# EAGLE design 611_jetbot_010210 (EAGLE 9.6.2)
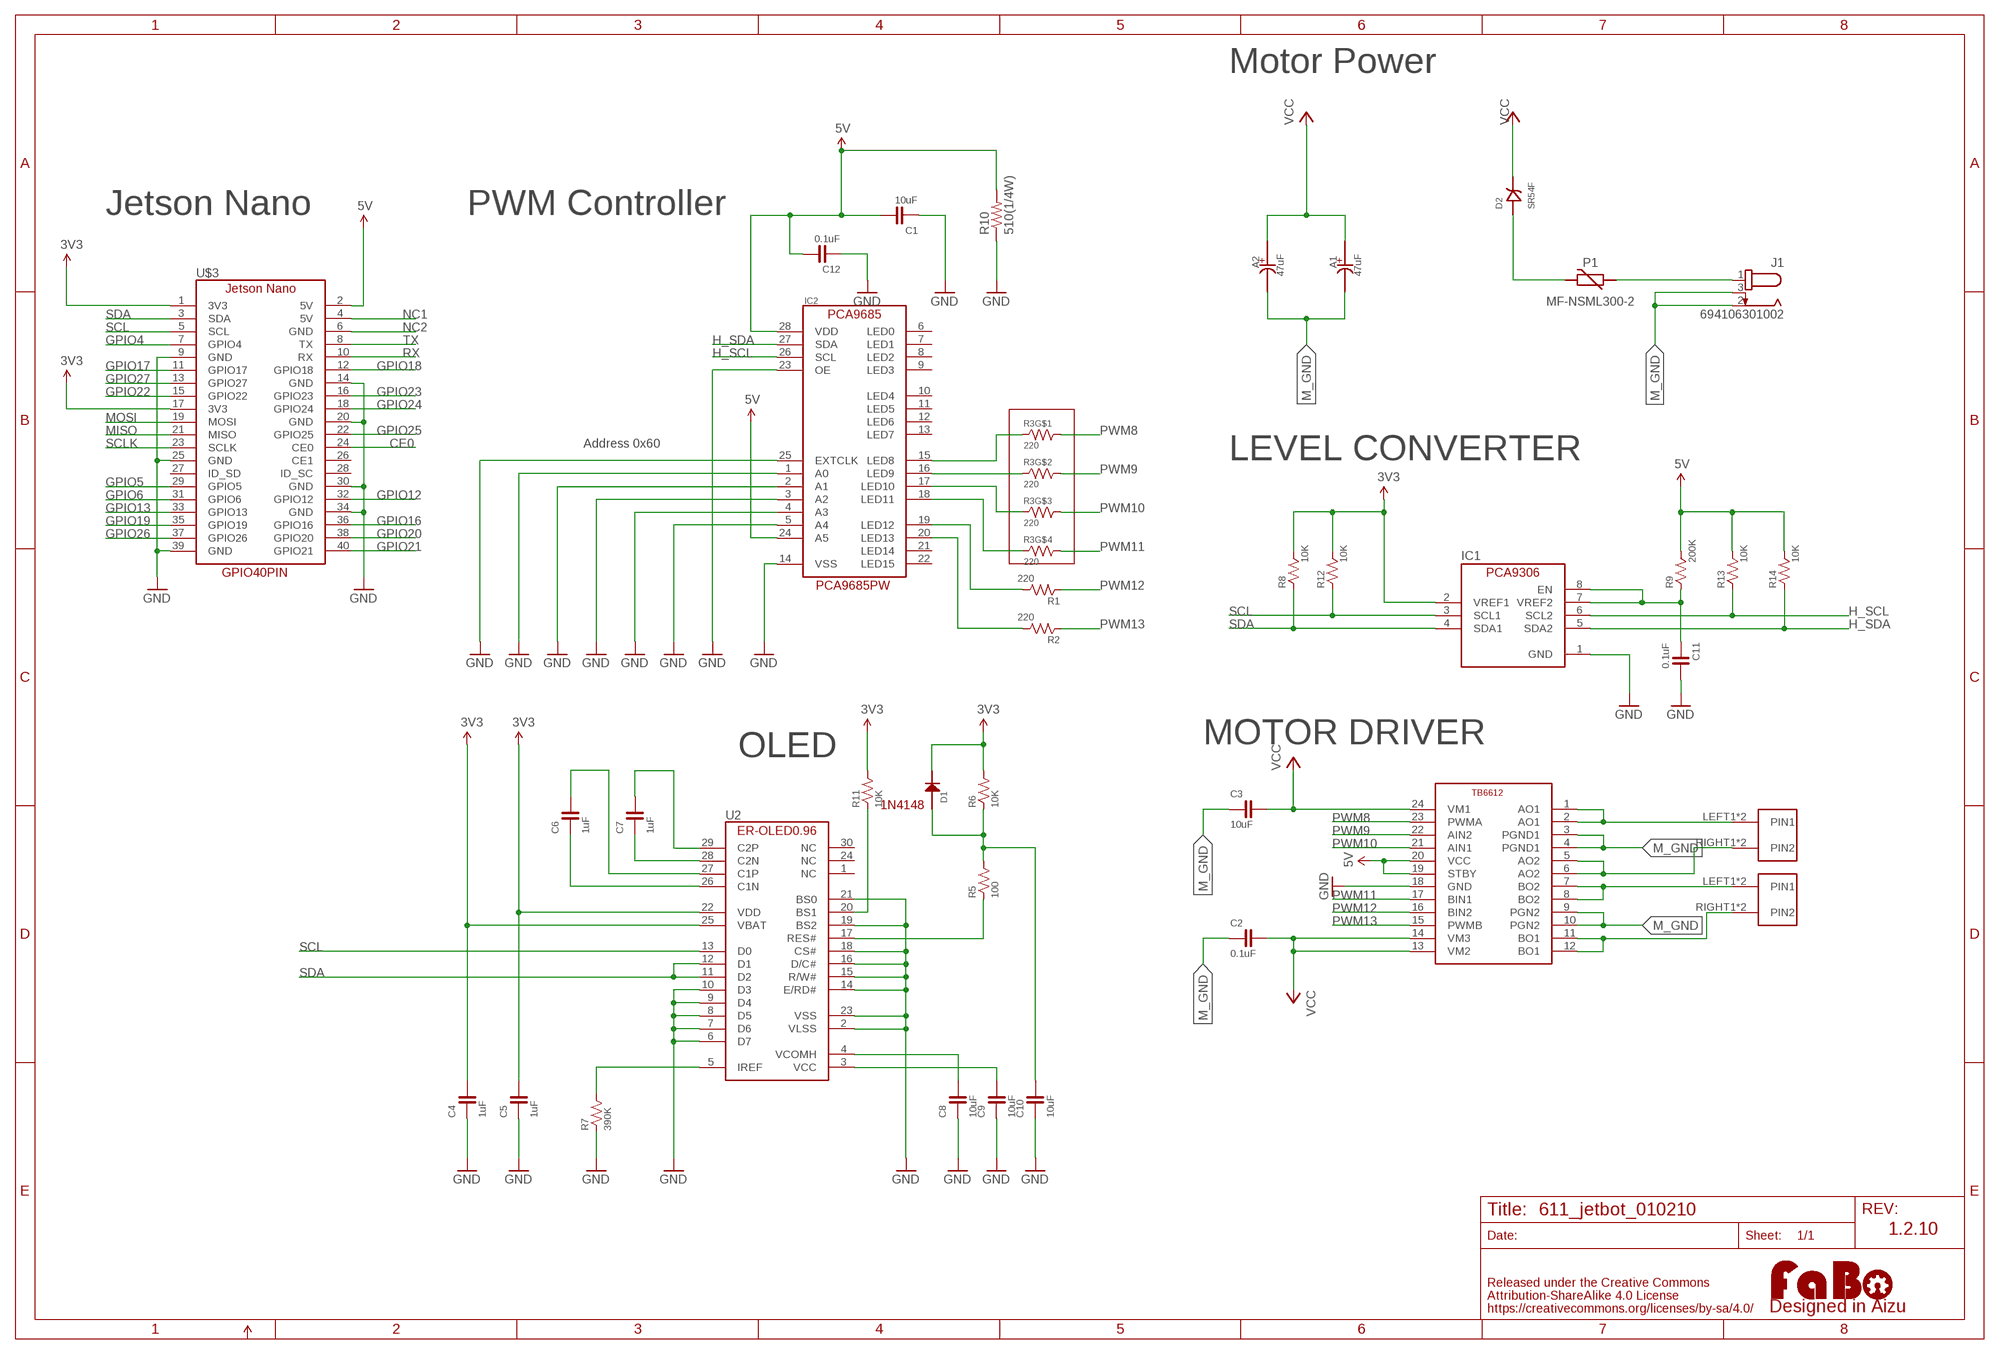
[diagram p0: schematic, sheet 1]

## Parts
A1  47uF  CAPACITOR-ALUMIN_D60  [D60]
A2  47uF  CAPACITOR-ALUMIN_D60  [D60]
C1  10uF  CAPACITOR-0603  [0603]
C2  0.1uF  CAPACITOR-0603  [0603]
C3  10uF  CAPACITOR-0603  [0603]
C4  1uF  CAPACITOR-0603-BOTTOM  [0603-BOTTOM]
C5  1uF  CAPACITOR-0603-BOTTOM  [0603-BOTTOM]
C6  1uF  CAPACITOR-0603-BOTTOM  [0603-BOTTOM]
C7  1uF  CAPACITOR-0603-BOTTOM  [0603-BOTTOM]
C8  10uF  CAPACITOR-0603-BOTTOM  [0603-BOTTOM]
C9  10uF  CAPACITOR-0603-BOTTOM  [0603-BOTTOM]
C10  10uF  CAPACITOR-0603-BOTTOM  [0603-BOTTOM]
C11  0.1uF  CAPACITOR-0603  [0603]
C12  0.1uF  CAPACITOR-0603  [0603]
D1  1N4148  [1N4148W]
D2  SR54F  [SMBF]
IC1  PCA9306_SSOP  [8PIN-SSOP]
IC2  PCA9685PW,BS  [PCA9685]
J1  694106301002  [694106301002]
LOGO1  LOGO_FABO-M  [LOGO_FABO_M]
P1  MF-NSML300-2  POLYSWITCH1206  [1206]
R1  220  RESISTOR-0603  [0603]
R2  220  RESISTOR-0603  [0603]
R3  220  RESISTOR_ARRAY  [EXBV8V]
R5  100  RESISTOR-0603-BOTTOM  [0603-BOTTOM]
R6  10K  RESISTOR-0603-BOTTOM  [0603-BOTTOM]
R7  390K  RESISTOR-0603-BOTTOM  [0603-BOTTOM]
R8  10K  RESISTOR-0603  [0603]
R9  200K  RESISTOR-0603  [0603]
R10  510(1/4W)  R-US_R0805  [R0805]
R11  10K  RESISTOR-0603-BOTTOM  [0603-BOTTOM]
R12  10K  RESISTOR-0603  [0603]
R13  10K  RESISTOR-0603  [0603]
R14  10K  RESISTOR-0603  [0603]
U2  ER-OLED0.96-1ER-CON30HT-1_REV2  [ER-CON30HT-1_REV2]
U$3  JETSON_NANO  [JETSON_NANO]
U$5  TB6612  [TB6612]
U$6  ML-1400-S1  [ML-1400-S1]
U$8  ML-1400-S1  [ML-1400-S1]

## Nets
3V3: C4.2 C5.2 D1.CATHODE IC1.2(VREF1) R6.2 R8.2 R11.2 R12.2 U2.22(VDD) U2.25(VBAT) U$3.1(3V3) U$3.17(3V3)
5V: C1.2 C12.2 IC2.24(A5) IC2.28(VDD) R9.2 R10.2 R13.2 R14.2 U$3.2(5V) U$5.19(STBY) U$5.20(VCC)
CE0: U$3.24(CE0)
GND: C1.1 C4.1 C5.1 C8.1 C9.1 C10.1 C11.2 C12.1 IC1.1(GND) IC2.1(A0) IC2.2(A1) IC2.3(A2) IC2.4(A3) IC2.5(A4) IC2.14(VSS) IC2.23(OE) IC2.25(EXTCLK) R7.1 R10.1 U2.2(VLSS) U2.6(D7) U2.7(D6) U2.8(D5) U2.9(D4) U2.10(D3) U2.14(E/RD#) U2.15(R/W#) U2.16(D/C#) U2.18(CS#) U2.19(BS2) U2.21(BS0) U2.23(VSS) U$3.9(GND) U$3.14(GND) U$3.20(GND) U$3.25(GND) U$3.30(GND) U$3.34(GND) U$3.39(GND) U$5.18(GND)
GPIO4: U$3.7(GPIO4)
GPIO5: U$3.29(GPIO5)
GPIO6: U$3.31(GPIO6)
GPIO12: U$3.32(GPIO12)
GPIO13: U$3.33(GPIO13)
GPIO16: U$3.36(GPIO16)
GPIO17: U$3.11(GPIO17)
GPIO18: U$3.12(GPIO18)
GPIO19: U$3.35(GPIO19)
GPIO20: U$3.38(GPIO20)
GPIO21: U$3.40(GPIO21)
GPIO22: U$3.15(GPIO22)
GPIO23: U$3.16(GPIO23)
GPIO24: U$3.18(GPIO24)
GPIO25: U$3.22(GPIO25)
GPIO26: U$3.37(GPIO26)
GPIO27: U$3.13(GPIO27)
H_SCL: IC1.6(SCL2) IC2.26(SCL) R13.1
H_SDA: IC1.5(SDA2) IC2.27(SDA) R14.1
M_GND: A1.MINUS(-) A2.MINUS(-) C2.1 C3.1 J1.2 J1.3 U$5.3(PGND1) U$5.4(PGND1) U$5.9(PGN2) U$5.10(PGN2)
MISO: U$3.21(MISO)
MOSI: U$3.19(MOSI)
N$14: C6.2 U2.27(C1P)
N$16: C6.1 U2.26(C1N)
N$17: U$5.1(AO1) U$5.2(AO1) U$6.LEFT1(PIN1) U$6.LEFT2(PIN1)
N$18: U$5.5(AO2) U$5.6(AO2) U$6.RIGHT1(PIN2) U$6.RIGHT2(PIN2)
N$19: C7.1 U2.28(C2N)
N$20: U$5.7(BO2) U$5.8(BO2) U$8.LEFT1(PIN1) U$8.LEFT2(PIN1)
N$21: C7.2 U2.29(C2P)
N$22: U$5.11(BO1) U$5.12(BO1) U$8.RIGHT1(PIN2) U$8.RIGHT2(PIN2)
N$23: R7.2 U2.5(IREF)
N$24: C8.2 U2.4(VCOMH)
N$25: C9.2 U2.3(VCC)
N$26: R5.1 U2.17(RES#)
N$27: C10.2 D1.ANODE R5.2 R6.1
N$28: R11.1 U2.20(BS1)
N$29: C11.1 IC1.7(VREF2) IC1.8(EN) R9.1
NC1: U$3.4(5V)
NC2: U$3.6(GND)
P8: IC2.15(LED8) R3.1
P9: IC2.16(LED9) R3.2
P10: IC2.17(LED10) R3.3
P11: IC2.18(LED11) R3.4
P12: IC2.19(LED12) R1.2
P13: IC2.20(LED13) R2.2
PTCP1: J1.1 P1.1
PTCP2: D2.ANODE P1.2
PWM8: R3.8 U$5.23(PWMA)
PWM9: R3.7 U$5.22(AIN2)
PWM10: R3.6 U$5.21(AIN1)
PWM11: R3.5 U$5.17(BIN1)
PWM12: R1.1 U$5.16(BIN2)
PWM13: R2.1 U$5.15(PWMB)
RX: U$3.10(RX)
SCL: IC1.3(SCL1) R12.1 U2.13(D0) U$3.5(SCL)
SCLK: U$3.23(SCLK)
SDA: IC1.4(SDA1) R8.1 U2.11(D2) U2.12(D1) U$3.3(SDA)
TX: U$3.8(TX)
VCC: A1.PLUS(+) A2.PLUS(+) C2.2 C3.2 D2.CATHODE U$5.13(VM2) U$5.14(VM3) U$5.24(VM1)
Unconnected: IC2.6(LED0) IC2.7(LED1) IC2.8(LED2) IC2.9(LED3) IC2.10(LED4) IC2.11(LED5) IC2.12(LED6) IC2.13(LED7) IC2.21(LED14) IC2.22(LED15) U2.1(NC) U2.24(NC) U2.30(NC) U$3.26(CE1) U$3.27(ID_SD) U$3.28(ID_SC)

## Notes on the sheet
- Motor Power
- Jetson Nano | PWM Controller
- Address 0x60
- LEVEL CONVERTER
- GPIO40PIN
- PCA9685PW
- MOTOR DRIVER
- OLED
- 1N4148
- 1.2.10

## Library data of the parts
A1 A2 = FaBo-Capacitor:CAPACITOR-ALUMIN
C1-C12 = FaBo-Capacitor:CAPACITOR: CAPACITOR
D1 = FaBo-Diode:1N4148
D2 = FaBo-Diode:SR54F: SURFACE MOUNT SCHOTTKY BARRIER RECTIFIER 40V Volts 5 Amperes SMBF molded plastic Forwaord Voltage 0.55V DC Reverse Current 0.1mA
IC1 = FaBo-LevelTranslator:PCA9306
IC2 = FaBo-Motor:PCA9685PW,BS
J1 = DC Power Jacks:694106301002: CONN PWR JACK 2.1X5.5MM SOLDER Manufacturer's datasheet <https://katalog.we-online.de/em/datasheet/6941xx301002.pdf>; CREATED_BY: PCBLayout.com; DIGIKEY_PART_NUMBER: 732-5930-ND; MANUFACTURER: Wurth Electronics Inc.; MPN: 694106301002
LOGO1 = component:LOGO_FABO
P1 = FaBo-Supply:POLYSWITCH
R1 R2 R5-R9 R11-R14 = FaBo-Resistors:RESISTOR: RESISTOR
R3 = component:RESISTOR_ARRAY
R10 = rcl:R-US_: RESISTOR, American symbol; SPICEPREFIX: R
U2 = FaBo-Display:ER-OLED0.96-1: ER-CON30HT-1 Rev2 wide distance 0.23mm
U$3 = FaBo-Boards:JETSON_NANO
U$5 = FaBo-Motor:TB6612
U$6 U$8 = FaBo-Terminal:ML-1400-S1

## Board
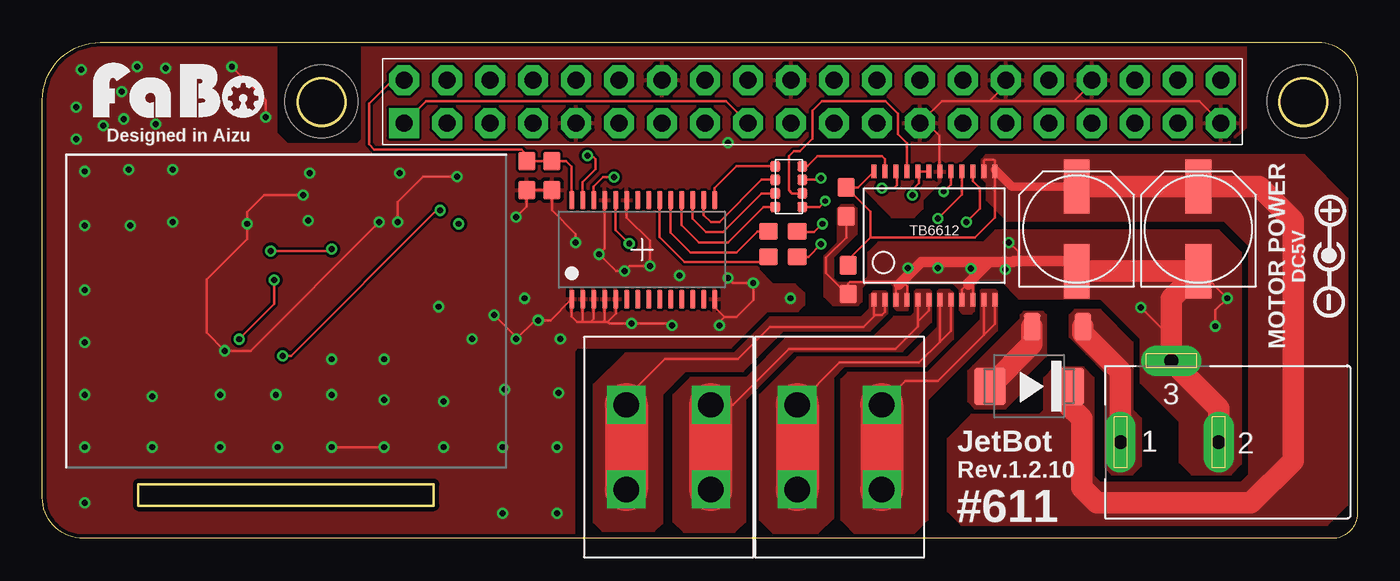
[diagram p1: board, top side]
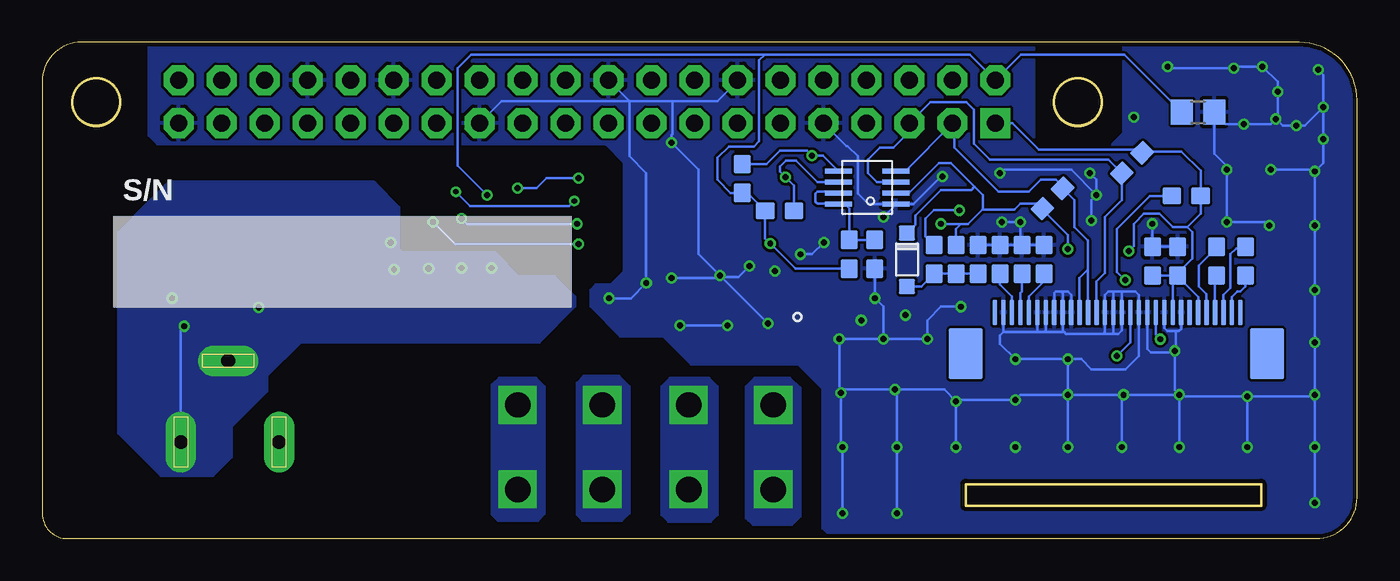
[diagram p2: board, bottom side, seen from below]

Size 70.23 x 25.26 mm. Coordinates in mm from the lower left corner, seen from the top.
Outline: 0,0 17.46,0 17.46,1.27 0,1.27 0,0
Outline: circle at 10.83,23.86 radius 1.4
Outline: circle at 68.83,23.86 radius 1.4
Copper layers (1*16): Top 0.035mm / dielectric 1.6mm / Bottom 0.035mm
Design rules "PCBway": minimum track width 6mil, minimum drill 12mil, track to track 6mil, track to pad 6mil, pad to pad 6mil, via to via 6mil, smd to smd 6mil, copper to edge 10mil, drill to drill 10mil, minimum pad ring 10mil, minimum via ring 6mil, stop-mask expansion 2mil, vias tented up to drill 100mil, thermal gap 8mil
tKeepout: area 23.5,-3 to 26.2,10
tRestrict: 4 lines
bRestrict: 8 lines

### Footprints (pad centres in the part's own frame; a part is rotated, then mirrored left to right if it is on the bottom)
D60 = smd 3.2 x 1.524: MINUS -2.5,0; PLUS 2.5,0
0603 = smd 1.1 x 1: 1 -0.85,0; 2 0.85,0
0603-BOTTOM = smd 1.1 x 1 bottom: 1 -0.85,0; 2 0.85,0
1N4148W = smd 0.9 x 0.95: ANODE 0,0; CATHODE 3.15,0
SMBF = smd 1.85 x 2.2: ANODE 2.325,0; CATHODE -2.325,0
8PIN-SSOP = smd 0.3 x 1.6: 1 -0.975,-1.7; 2 -0.325,-1.7; 3 0.325,-1.7; 4 0.975,-1.7; 5 0.975,1.7; 6 0.325,1.7; 7 -0.325,1.7; 8 -0.975,1.7
PCA9685 = smd 0.3 x 1.1: 1 -4.15,-2.93; 2 -3.5,-2.93; 3 -2.85,-2.93; 4 -2.2,-2.93; 5 -1.55,-2.93; 6 -0.9,-2.93; 7 -0.25,-2.93; 8 0.4,-2.93; 9 1.05,-2.93; 10 1.7,-2.93; 11 2.35,-2.93; 12 3,-2.93; 13 3.65,-2.93; 14 4.3,-2.93; 15 4.3,2.92; 16 3.65,2.92; 17 3,2.92; 18 2.35,2.92; 19 1.7,2.92; 20 1.05,2.92; 21 0.4,2.92; 22 -0.25,2.92; 23 -0.9,2.92; 24 -1.55,2.92; 25 -2.2,2.92; 26 -2.85,2.92; 27 -3.5,2.92; 28 -4.15,2.92
694106301002 = drill 0.8 pad 1.8 long: 1 13.6,0; 2 7.8,0; 3 10.6,-4.8
1206 = smd 1 x 1.6: 1 -1.5,0; 2 1.5,0
EXBV8V = smd 0.6 x 0.6: 1 -1.2,-0.8; 2 -0.4,-0.8; 3 0.4,-0.8; 4 1.2,-0.8; 5 1.2,0.8; 6 0.4,0.8; 7 -0.4,0.8; 8 -1.2,0.8
R0805 = smd 1.3 x 1.5: 1 -0.95,0; 2 0.95,0
ER-CON30HT-1_REV2 = smd 0.27 x 1.5 bottom: 1 7,-0.23; 2 6.5,-0.23; 3 6,-0.23; 4 5.5,-0.23; 5 5,-0.23; 6 4.5,-0.23; 7 4,-0.23; 8 3.5,-0.23; 9 3,-0.23; 10 2.5,-0.23; 11 2,-0.23; 12 1.5,-0.23; 13 1,-0.23; 14 0.5,-0.23; 15 0,-0.23; 16 -0.5,-0.23; 17 -1,-0.23; 18 -1.5,-0.23; 19 -2,-0.23; 20 -2.5,-0.23; 21 -3,-0.23; 22 -3.5,-0.23; 23 -4,-0.23; 24 -4.5,-0.23; 25 -5,-0.23; 26 -5.5,-0.23; 27 -6,-0.23; 28 -6.5,-0.23; 29 -7,-0.23; 30 -7.5,-0.23 | smd 2 x 3 bottom: 31 -9.07,-2.67; 32 8.74,-2.67
JETSON_NANO = drill 1 pad 1.778 square: 1 -24.13,10.16 | drill 1 pad 1.778 octagon: 2 -24.13,12.7; 3 -21.59,10.16; 4 -21.59,12.7; 5 -19.05,10.16; 6 -19.05,12.7; 7 -16.51,10.16; 8 -16.51,12.7; 9 -13.97,10.16; 10 -13.97,12.7; 11 -11.43,10.16; 12 -11.43,12.7; 13 -8.89,10.16; 14 -8.89,12.7; 15 -6.35,10.16; 16 -6.35,12.7; 17 -3.81,10.16; 18 -3.81,12.7; 19 -1.27,10.16; 20 -1.27,12.7; 21 1.27,10.16; 22 1.27,12.7; 23 3.81,10.16; 24 3.81,12.7; 25 6.35,10.16; 26 6.35,12.7; 27 8.89,10.16; 28 8.89,12.7; 29 11.43,10.16; 30 11.43,12.7; 31 13.97,10.16; 32 13.97,12.7; 33 16.51,10.16; 34 16.51,12.7; 35 19.05,10.16; 36 19.05,12.7; 37 21.59,10.16; 38 21.59,12.7; 39 24.13,10.16; 40 24.13,12.7
TB6612 = smd 0.3 x 0.8: 1 -3.575,-3.8; 2 -2.925,-3.8; 3 -2.275,-3.8; 4 -1.625,-3.8; 5 -0.975,-3.8; 6 -0.325,-3.8; 7 0.325,-3.8; 8 0.975,-3.8; 9 1.625,-3.8; 10 2.275,-3.8; 11 2.925,-3.8; 12 3.575,-3.8; 13 3.575,3.8; 14 2.925,3.8; 15 2.275,3.8; 16 1.625,3.8; 17 0.975,3.8; 18 0.325,3.8; 19 -0.325,3.8; 20 -0.975,3.8; 21 -1.625,3.8; 22 -2.275,3.8; 23 -2.925,3.8; 24 -3.575,3.8
ML-1400-S1 = drill 1.5 square: LEFT1 -2.5,2.5; LEFT2 -2.5,-2.5; RIGHT1 2.5,2.5; RIGHT2 2.5,-2.5

### Placement (x,y rotation side)
A1  62.63,16.36 90 top
A2  55.43,16.36 90 top
C1  22.95,19.51 90 top
C2  41.93,13.36 90 top
C3  41.83,17.96 90 top
C4  4.93,14.46 270 top
C5  6.43,14.46 270 top
C6  2.63,14.46 270 top
C7  0.93,14.46 270 top
C8  14.13,14.56 270 top
C9  15.43,14.56 270 top
C10  16.73,14.56 270 top
C11  22.83,14.86 270 bottom
C12  24.43,19.51 90 top
D1  20.93,12.96 90 bottom
D2  52.63,7.06 180 top
IC1  23.28,18.81 90 bottom
IC2  29.75,15.14 0 top
J1  71.63,3.76 180 top
LOGO1  2.38,22.56 0 top
P1  54.31,10.58 180 top
R1  38.08,16.21 180 top
R2  38.08,14.71 180 top
R3  38.43,18.86 270 top
R5  19.33,14.56 270 top
R6  18.03,14.56 90 top
R7  12.83,14.56 270 top
R8  12.33,18.16 225 bottom
R9  24.33,14.86 270 bottom
R10  3.73,23.26 180 bottom
R11  4.43,18.31 180 top
R12  7.63,20.26 45 bottom
R13  28.45,17.44 180 bottom
R14  30.66,19.34 270 bottom
U2  8.73,11.66 0 top
U$3  39.83,12.46 0 top
U$5  47.03,15.96 0 top
U$6  31.33,3.46 0 top
U$8  41.43,3.46 0 top

### Tracks (layer width: path | path; a pad name or v marks a point on that pad's centre or on a via)
3V3  (via drill 0.35)
  Top 0.152: v7.83,15.06 11.33,15.06 v11.43,15.16 | U$3.17 34.73,23.91 16.99,23.91 U$3.1
  Bottom 0.152: R6.2 18.03,16.36 17.73,16.66 | 16.48,17.51 17.33,16.66 17.73,16.66 | 16.48,17.51 16.43,17.56 16.43,18.36 16.93,18.86 | v11.43,15.16 11.43,16.01 12.93,17.51 R8.2 13.23,17.86 14.23,17.86 14.58,17.51 16.48,17.51 | v18.93,16.66 17.73,16.66 | C4.2 4.93,13.75 | 4.93,13.75 4.08,14.61 4.08,16.16 4.38,16.46 | v7.83,15.06 7.53,15.36 7.53,16.66 6.93,17.26 6.03,17.26 5.23,16.46 4.38,16.46 | 5.07,13.61 4.93,13.75 | U$3.1 14.7,22.62 13.14,21.06 7.23,21.06 7.1,20.94 | 16.93,18.86 18.33,20.26 19.03,20.26 20.8,18.48 IC1.2 | 16.93,18.86 17.13,18.66 18.93,18.66 20.43,17.16 20.43,16.61 D1.CATHODE | R12.2 7.1,20.94 | 7.1,20.94 4.71,20.94 3.58,19.81 R11.2 3.58,17.26 4.38,16.46 | 4.93,13.48 C4.2 | C5.2 5.07,13.61 | U2.25 3.73,12.34 4.93,13.54 C4.2 | U2.22 5.23,13.45 5.07,13.61
5V  (via drill 0.35)
  Top 0.152: U$3.2 15.03,25.16 13.63,23.76 13.63,21.36 13.93,21.06 22.63,21.06 22.95,20.75 C1.2 C12.2 25.28,20.36 25.6,20.04 IC2.28 | U$5.19 U$5.20 46.13,19.69 46.13,19.06 45.73,18.66 v45.73,18.36 | IC2.24 28.2,16.29 v29,15.48
  Bottom 0.152: 29.33,26.67 46.67,26.67 47.48,25.86 47.48,20.11 v45.73,18.36 | 29.33,26.67 17.21,26.67 U$3.2 14.2,26.66 8.08,26.66 R10.2 | 29.33,26.67 29.68,26.32 29.68,21.54 29.98,21.23 31.45,21.23 32.13,20.56 32.13,19.26 31.35,18.48 R14.2 30.35,18.48 R13.2 29.3,15.79 v29,15.48 27.53,14.01 R9.2
GND  (via drill 0.35)
  Top 0.152: 50.28,23.91 47.47,23.91 46.27,22.71 | 46.27,22.71 U$3.25 | v14.23,16.76 6.63,9.16 v5.1,9.16 4.03,10.23 4.03,13.36 6.43,15.76 v6.43,16.66 6.43,17.36 7.43,18.36 v9.73,18.36 | U$3.30 51.26,24.89 50.28,23.91 | U$3.39 62.67,23.91 55.28,23.91 | 50.28,23.91 55.28,23.91 | U$3.34 56.34,24.97 55.28,23.91 | v14.53,3.46 v11.43,3.46 | U$5.18 47.33,19.79 47.33,21.86 46.48,22.71 46.27,22.71 | v18.83,19.46 16.83,19.46 15.33,17.96 v15.33,16.76 | v7.53,22.96 7.53,23.96 v5.53,25.96 | v21.03,11.26 22.33,9.96 v22.33,9.86 23.43,10.96 v23.63,10.96 24.36,10.96 IC2.1 25.6,11.18 25.93,10.86 26.23,10.86 | 27.73,10.86 28.23,11.36 28.23,12.18 IC2.5 | 26.23,10.86 26.73,10.86 | 26.73,10.86 27.43,10.86 | 27.43,10.86 27.73,10.86 | IC2.4 27.55,10.98 27.43,10.86 | IC2.3 26.91,11.04 26.73,10.86 | IC2.2 26.25,10.89 26.23,10.86 | IC2.14 34.05,11.73 34.63,11.16 | 34.63,11.16 35.33,11.16 36.33,12.16 v36.33,13.16 35.13,13.16 v34.83,13.46 | 27.73,10.86 27.83,10.76 v29.13,10.76 31.43,10.76 v31.53,10.66 | v34.33,10.66 34.33,10.86 34.63,11.16 | v22.33,17.06 22.95,17.68 C1.1 C12.1 24.43,17.46 25.83,16.06 v25.83,15.56 | IC2.25 27.55,15.19 v27.23,14.86 28.23,13.86 v28.73,13.86 29.03,14.16 v30.23,14.16 30.23,15.66 28.85,17.04 IC2.23
  Bottom 0.152: 37.31,23.91 34.78,23.91 | 34.78,23.91 32.13,23.91 30.94,25.1 U$3.14 | 37.33,23.91 37.31,23.91 | 37.31,23.91 U$3.20 | U$3.25 44.89,23.91 37.33,23.91 | 15.23,10.26 13.13,10.26 | 13.13,10.26 12.83,10.26 | 12.83,10.26 11.63,10.26 | 11.63,10.26 11.73,10.36 U2.9 11.73,12.56 11.83,12.66 | 5.03,10.34 5.55,10.34 5.73,10.51 U2.21 | 5.03,10.34 4.86,10.34 4.73,10.46 U2.23 | C4.1 C5.1 v6.43,16.66 | R7.1 C8.1 | C8.1 C9.1 C10.1 | C8.1 14.23,15.51 v14.23,16.76 v15.33,16.76 | 5.03,10.34 5.03,9.23 v5.1,9.16 5.1,9.06 | 15.23,10.26 15.43,10.06 15.43,9.56 v14.53,8.66 v11.43,8.66 | v9.73,18.36 11.23,19.86 15.23,19.86 v15.43,19.66 | v-3.17,19.76 -3.07,19.86 v-0.57,19.86 | v-3.17,19.76 v-3.17,16.56 v-3.17,12.76 v-3.17,9.66 v-3.17,6.56 | v-3.17,6.56 -3.07,6.46 v0.83,6.46 | 5.1,9.06 5.1,6.83 v4.83,6.56 | v4.83,6.56 4.73,6.46 v0.83,6.46 | v4.83,6.56 v8.13,6.56 | v8.13,6.56 v11.43,6.56 | v11.43,8.66 v11.43,6.56 | v-3.17,6.56 v-3.17,3.46 v-3.17,0.16 | v0.83,6.46 v0.83,3.46 | v4.83,6.56 v4.83,3.46 | v8.13,6.56 8.23,6.46 v8.23,3.46 | v11.43,6.56 v11.43,3.46 | U2.19 6.73,9.26 6.53,9.06 5.1,9.06 | v11.43,8.66 10.63,8.66 10.03,8.06 8.03,8.06 7.23,8.86 U2.18 7.23,12.46 7.43,12.66 8.23,12.66 | 11.63,10.26 11.53,10.16 9.33,10.16 | 8.73,10.16 8.43,10.16 8.23,10.36 U2.16 8.23,12.66 | 8.73,10.16 9.33,10.16 | 8.73,10.16 U2.15 8.73,12.66 | 9.33,10.16 9.23,10.26 U2.14 9.23,12.46 9.03,12.66 8.73,12.66 | 11.83,12.66 11.43,12.66 11.23,12.46 U2.10 | 11.83,12.66 12.13,12.66 12.23,12.56 U2.8 | U2.2 15.23,10.26 | U2.6 13.23,10.36 13.13,10.26 | U2.7 12.73,10.36 12.83,10.26 | 8.23,12.66 8.73,12.66 | U$3.9 24.5,21.26 24.43,21.26 23.83,20.66 23.83,18.46 23.2,17.84 IC1.1 21.55,17.84
  Bottom 0.152: 37.33,23.91 37.33,20.66 36.33,19.66 v36.33,13.16 37.23,12.26 v38.53,12.26 | C11.2 v22.83,12.26 22.33,11.76 22.33,9.96 | v18.83,19.46 18.93,19.46 20.55,17.84 21.55,17.84 | v-3.67,23.56 -3.67,25.46 v-3.37,25.76 | v-3.67,23.56 v-3.67,21.66 -3.67,20.26 v-3.17,19.76 | v-0.87,22.86 -0.57,22.56 v1.03,22.56 2.08,22.56 R10.1 2.78,20.81 1.83,19.86 v2.03,19.86 2.13,19.86 2.03,19.76 v2.03,16.76 -0.27,16.76 v-0.47,16.56 | v-0.87,22.86 -0.97,22.96 v-0.97,24.46 -0.97,25.06 v-0.07,25.96 1.53,25.96 v1.63,25.86 5.43,25.86 v5.53,25.96 | v-3.67,23.56 -2.57,22.46 v-2.07,22.46 -1.27,22.46 v-0.87,22.86 | v11.43,6.56 14.23,6.56 v14.53,6.26 17.93,6.26 v18.03,6.16 | v18.03,6.16 18.73,6.86 v21.63,6.86 21.73,6.86 | 21.73,6.86 24.63,6.86 24.68,6.81 | 24.68,6.81 v24.83,6.66 24.83,3.56 v24.73,3.46 v24.73,-0.44 | 21.73,6.86 21.53,6.66 v21.53,3.46 v21.53,-0.44 | v18.03,3.46 v18.03,6.16 | v17.73,11.76 18.93,11.76 19.73,10.96 v19.73,9.86 v22.33,9.86 22.33,9.96 | 22.33,9.96 22.43,9.86 v24.93,9.86 24.93,7.06 24.68,6.81 | 34.78,23.91 34.78,21.96 34.83,21.91 v34.83,21.46 33.23,19.86 33.23,14.86 v31.98,13.61 | v9.73,18.36 9.73,19.26 v10.13,19.66 | v10.03,16.86 10.03,18.06 v9.73,18.36 | v31.98,13.61 31.88,13.51 | 31.88,13.51 v29.13,10.76 | 31.88,13.51 30.88,13.51 v30.23,14.16 | v27.23,14.86 26.53,14.86 v25.83,15.56 | v31.53,10.66 v34.33,10.66 | v22.33,17.06 21.55,17.84 | v34.83,13.46 32.13,13.46 v31.98,13.61
  pour Bottom: -6.97,25.46 -3.37,29.06 6.33,29.06 8.13,27.26 8.13,22.06 8.93,21.26 13.23,21.26 13.43,21.46 13.43,27.26 15.43,29.26 63.63,29.26 65.73,27.16 65.73,21.86 65.23,21.36 38.73,21.36 37.63,20.26 37.63,13.86 38.43,13.06 39.33,13.06 39.63,12.76 39.63,11.76 37.88,10.01 35.33,10.01 33.68,8.36 27.38,8.36 25.93,6.91 25.93,-1.34 24.33,-2.94 -3.47,-2.94 -6.97,0.56
  pour Top: -8.07,25.26 -3.97,29.36 6.73,29.36 8.13,27.96 8.13,22.06 8.83,21.36 12.93,21.36 13.23,21.66 13.23,27.56 15.53,29.86 63.83,29.86 65.43,28.26 65.43,22.36 64.43,21.36 49.63,21.36 46.33,18.06 46.33,17.56 45.83,17.06 44.53,17.06 42.83,18.76 42.83,19.66 41.78,20.71 37.68,20.71 36.63,19.66 36.63,13.96 37.5,13.09 38.8,13.09 39.33,12.56 39.33,11.86 38.98,11.51 37.18,11.51 35.03,9.36 25.93,9.36 25.73,9.16 25.73,-2.04 24.43,-3.34 -5.77,-3.34 -8.07,-1.04
H_SCL  (via drill 0.35)
  Top 0.152: IC2.26 26.91,18.86 27.45,19.41 v28.1,19.41
  Bottom 0.152: IC1.6 26.23,19.14 27.48,20.39 28.08,20.39 28.43,20.04 28.43,19.73 v28.1,19.41 27.6,18.91 R13.1
H_SDA  (via drill 0.35)
  Top 0.152: v26.53,20.69 26.8,20.69 27,20.48 27,19.89 26.25,19.14 IC2.27
  Bottom 0.152: IC1.5 25.88,20.69 v26.53,20.69 26.83,20.98 28.43,20.98 29.23,20.19 R14.1
M_GND  (via drill 0.35)
  Top 0.152: 44.93,13.06 45.33,13.06 45.43,12.96 45.43,12.18 U$5.4 | 44.93,13.06 44.78,13.21 42.03,13.21 41.93,13.11 C2.1 41.88,12.51 40.63,13.76 40.63,14.66 41.83,15.86 C3.1 | U$5.10 49.3,12.98 49.23,13.06 49.03,13.06 48.93,13.06 48.66,12.79 U$5.9 | v45.48,14.06 45.41,13.98 45.41,13.54 | v51.43,15.56 51.98,15.01 51.98,14.46 | v59.23,11.71 61.03,9.91 61.03,9.51 | v63.63,10.61 63.63,11.56 v64.33,12.26 62.73,13.86 A1.MINUS | 51.73,14.46 v51.23,13.96 | v47.23,14.06 47.23,14.36 47.28,14.41 | v49.18,14.01 49.18,14.41 | U$5.3 44.75,12.89 44.93,13.06
  Top 0.61: A2.MINUS 54.83,14.46 51.98,14.46 51.73,14.46 51.68,14.41 50.28,14.41 | 50.28,14.41 49.03,13.16 49.03,13.06 | 50.28,14.41 49.18,14.41 47.28,14.41 46.28,14.41 45.41,13.54 44.93,13.06
  Top 1.27: J1.2 63.83,5.76 J1.3 61.03,9.51 61.03,12.26 A1.MINUS A2.MINUS
  Bottom 0.152: J1.2 63.83,10.41 v63.63,10.61
  pour Top (no thermals): 56.83,12.26 59.23,9.86 59.23,7.26 61.53,4.96 61.53,2.56 62.23,1.86 64.53,1.86 65.13,2.46 65.13,14.96 63.83,16.26 50.63,16.26 49.93,15.56 43.73,15.56 43.13,14.96 43.13,13.56 42.73,13.16 41.33,13.16 41.03,13.46 41.03,14.66 42.43,16.06 42.43,17.56 42.23,17.76 41.53,17.76 41.33,17.56 41.33,15.56 40.53,14.76 40.53,12.36 41.03,11.86 42.53,11.86 42.73,12.06 42.73,12.86 43.03,13.16 44.43,13.16 44.63,12.96 44.63,11.76 44.83,11.56 45.43,11.56 45.43,13.16 48.13,13.16 48.53,12.76 48.53,11.56 48.73,11.36 49.23,11.36 49.38,11.51 49.38,13.01 49.73,13.36 50.93,13.36 52.03,12.26
  pour Bottom (no thermals): 60.83,2.86 61.93,1.76 65.03,1.76 67.53,4.26 67.53,9.16 67.53,16.16 64.53,19.16 52.43,19.16 52.33,19.06 50.93,17.66 50.93,15.16 50.73,14.96 45.23,14.96 43.83,13.56 41.73,13.56 40.53,12.36 40.53,11.76 42.63,9.66 56.73,9.66 58.73,7.66 58.73,6.76 60.83,4.66
N$14
  Bottom 0.152: C6.2 2.73,13.51 U2.27
N$16
  Bottom 0.152: C6.1 2.63,15.26 3.68,14.21 3.68,12.96 3.23,12.51 U2.26
N$17
  Top 0.152: U$5.1 43.45,11.26 43.55,11.26 | 43.55,11.26 42.85,10.56 37.33,10.56 35.43,8.66 31.13,8.66 27.93,5.46 28.33,5.46 U$6.LEFT1 | U$5.2 44.1,11.43 43.93,11.26 43.55,11.26
  Top 2.54: U$6.LEFT1 U$6.LEFT2
  pour Bottom (no thermals): 27.23,-0.64 27.23,6.96 27.83,7.56 29.93,7.56 30.43,7.06 30.43,-0.74 30.03,-1.14 27.73,-1.14
  pour Top (no thermals): 26.93,-0.99 26.93,7.16 28.78,9.01 35.2,9.01 37.33,11.14 42.7,11.14 43.23,11.66 43.23,12.46 43.43,12.66 44.13,12.66 44.23,12.56 44.23,11.36 43.23,10.36 38.13,10.36 35.73,7.96 32.33,7.96 30.93,6.56 30.93,-1.04 30.48,-1.49 27.43,-1.49
N$18
  Top 0.152: U$6.RIGHT1 35.13,5.96 38.43,9.26 44.73,9.26 46.05,10.59 46.05,10.89 | 46.05,10.89 U$5.5 | U$5.6 46.7,11.54 46.05,10.89
  Top 2.54: U$6.RIGHT2 U$6.RIGHT1
  pour Bottom (no thermals): 32.13,7.06 32.63,7.56 34.93,7.56 35.43,7.06 35.43,-0.54 35.03,-0.94 32.53,-0.94 32.13,-0.54
  pour Top (no thermals): 31.63,-0.94 32.23,-1.54 35.23,-1.54 35.83,-0.94 35.83,6.26 38.73,9.16 45.13,9.16 46.83,10.86 46.83,12.66 46.73,12.76 45.98,12.76 45.88,12.66 45.88,11.41 45.63,11.16 44.63,11.16 43.43,9.96 38.33,9.96 35.93,7.56 32.63,7.56 31.63,6.56
N$19
  Bottom 0.152: C7.1 0.93,15.21 1.48,15.21 1.83,14.86 1.83,12.86 2.23,12.46 U2.28
N$20
  Top 0.152: U$8.LEFT1 41.43,8.46 46.13,8.46 47.35,9.68 | 47.35,9.68 U$5.7 | U$5.8 48,10.34 47.35,9.68
  Top 2.54: U$8.LEFT1 U$8.LEFT2
  pour Bottom (no thermals): 37.33,-0.44 37.33,7.06 37.93,7.66 40.03,7.66 40.43,7.26 40.43,-0.54 40.08,-0.89 37.78,-0.89
  pour Top (no thermals): 41.03,7.56 41.03,-0.74 40.13,-1.64 37.53,-1.64 36.73,-0.84 36.73,6.56 38.93,8.76 45.43,8.76 47.23,10.56 47.23,12.66 47.33,12.76 47.93,12.76 48.13,12.56 48.13,9.86 46.53,8.26 41.73,8.26
N$21
  Bottom 0.152: C7.2 0.93,12.95 1.22,12.66 1.4,12.66 1.73,12.33 U2.29
N$22
  Top 0.152: U$8.RIGHT1 45.33,7.36 47.23,7.36 49.95,10.09 | 49.95,10.09 U$5.11 | U$5.12 50.6,10.73 49.95,10.09
  Top 2.54: U$8.RIGHT1 U$8.RIGHT2
  pour Bottom (no thermals): 42.33,-0.49 42.33,7.06 42.83,7.56 45.03,7.56 45.43,7.16 45.43,-0.54 45.08,-0.89 42.73,-0.89
  pour Top (no thermals): 41.53,7.46 41.53,-0.84 42.53,-1.84 45.63,-1.84 46.63,-0.84 46.63,6.26 50.73,10.36 50.73,12.66 50.63,12.76 49.83,12.76 49.78,12.71 49.78,11.01 46.63,7.86 41.93,7.86
N$23
  Bottom 0.152: R7.2 12.83,13.26 13.73,12.36 U2.5
N$24
  Bottom 0.152: C8.2 14.13,12.66 14.23,12.56 U2.4
N$25
  Bottom 0.152: C9.2 15.43,13.06 14.73,12.36 U2.3
N$26  (via drill 0.35)
  Top 0.152: v8.53,8.86 9.03,8.86 17.63,17.46 v17.83,17.46
  Bottom 0.152: R5.1 19.83,15.91 19.83,16.96 19.33,17.46 v17.83,17.46 | v8.53,8.86 7.73,9.66 U2.17
N$27
  Bottom 0.152: D1.ANODE 20.08,12.96 R5.2 R6.1 C10.2
N$28  (via drill 0.35)
  Top 0.152: v5.96,9.84 8.04,11.92 v8.04,13.34
  Bottom 0.152: R11.1 6.57,18.31 8.52,16.36 8.52,13.82 v8.04,13.34 | v5.96,9.84 6.23,10.11 U2.20
N$29
  Bottom 0.152: C11.1 R9.1 24.33,17.56 24.6,17.84 IC1.8 25.01,17.86 26.23,17.86 26.33,17.96 26.33,18.46 26.23,18.56 25.05,18.56 IC1.7
P8
  Top 0.152: 37.53,20.16 R3.1 35.33,20.06 34.05,18.79 IC2.15
P9
  Top 0.152: IC2.16 33.41,17.19 33.83,16.76 34.33,16.76 36.83,19.26 R3.2
P10
  Top 0.152: R3.3 36.83,18.46 34.53,16.16 33.53,16.16 32.73,16.96 32.73,18.03 IC2.17
P11
  Top 0.152: R3.4 36.93,17.66 34.83,15.56 33.13,15.56 32.1,16.59 IC2.18
P12
  Top 0.152: IC2.19 31.45,16.14 32.63,14.96 35.33,14.96 36.58,16.21 R1.2
P13
  Top 0.152: 37.03,14.51 R2.2 36.93,14.41 32.28,14.41 30.8,15.89 IC2.20
PTCP1
  Top 1.27: J1.1 58.03,7.95 55.81,10.18 P1.1
  pour Top (no thermals): 57.13,2.76 57.13,7.86 56.03,8.96 55.03,9.96 55.03,11.26 55.33,11.56 56.13,11.56 56.83,11.56 58.73,9.66 58.73,5.66 58.93,5.46 59.23,5.16 59.23,2.36 58.73,1.86 57.53,1.86 57.13,2.26
PTCP2
  Top 1.27: D2.ANODE 52.81,9.56 P1.2
  pour Top (no thermals): 51.03,5.76 49.43,5.76 49.03,6.16 49.03,7.96 49.33,8.26 52.13,11.06 52.13,11.26 52.33,11.46 52.73,11.46 53.43,11.46 53.63,11.26 53.63,8.86 52.03,7.26 52.03,6.56 51.23,5.76
PWM8
  Top 0.152: R3.8 39.53,20.06 40.13,20.66 43.93,20.66 44.1,20.48 U$5.23
PWM9  (via drill 0.35)
  Top 0.152: v43.93,18.77 44.64,18.77 44.83,18.96 44.83,19.69 U$5.22 | v40.33,19.36 40.23,19.26 R3.7
  Bottom 0.152: v40.33,19.36 42.23,19.36 42.82,18.77 v43.93,18.77
PWM10
  Top 0.152: U$5.21 45.41,21.44 44.88,21.96 44.88,23.16 44.13,23.91 40.38,23.91 39.83,23.36 39.83,21.71 39.08,20.96 38.73,20.96 38.43,20.66 38.43,18.66 38.63,18.46 R3.6
PWM11  (via drill 0.3)
  Top 0.152: v47.58,18.56 48,18.98 U$5.17 | R3.5 40.23,17.66 v40.58,18.01
  Bottom 0.152: v40.58,18.01 40.88,17.71 46.73,17.71 v47.58,18.56
PWM12  (via drill 0.35)
  Top 0.152: v40.43,16.66 39.93,16.16 38.98,16.16 R1.1 | v47.23,16.96 48.66,18.39 U$5.16
  Bottom 0.152: v40.43,16.66 46.93,16.66 v47.23,16.96
PWM13  (via drill 0.35)
  Top 0.152: v48.93,16.76 49.73,17.56 49.73,18.76 49.3,19.19 U$5.15 | R2.1 39.58,14.71 v40.33,15.46
  Bottom 0.152: v40.33,15.46 47.63,15.46 v48.93,16.76
SCL
  Bottom 0.152: U2.13 9.73,13.26 9.23,13.76 9.23,17.06 8.23,18.06 R12.1 9.03,20.46 16.03,20.46 16.98,21.41 16.98,23.41 17.43,23.86 19.54,23.86 U$3.5 20.78,22.11 21.73,21.16 22.53,21.16 23.23,20.46 23.23,19.66 22.7,19.14 IC1.3
SDA
  Bottom 0.152: 10.23,13.96 10.73,13.46 U2.11 | U2.12 10.23,13.96 | IC1.4 21.02,19.79 18.24,22.57 U$3.3 18.13,22.51 18.13,21.16 15.53,18.56 13.73,18.56 13.03,19.26 12.13,19.26 11.63,18.76 R8.1 11.03,18.06 11.03,16.46 10.23,15.66 10.23,13.96
VCC
  Top 0.152: U$5.14 49.95,20.39 50.03,20.46 50.53,20.46 50.6,20.39 50.6,19.86 U$5.13 50.6,17.04 49.43,15.86 43.28,15.86 43.25,15.84 | U$5.24 42.5,18.81 C3.2 43.25,17.39 43.25,15.84 | 43.25,15.84 41.93,14.51 C2.2
  Top 0.508: A2.PLUS 51.6,18.86 50.6,19.86
  Top 1.27: A2.PLUS A1.PLUS 66.23,18.86 68.23,16.86 68.23,2.66 65.73,0.16 56.63,0.16 55.73,1.06 55.73,5.16 54.95,5.93 D2.CATHODE
  pour Top (no thermals): 53.53,7.56 54.13,8.16 55.83,8.16 56.43,7.56 56.43,1.76 56.83,1.36 65.13,1.36 65.63,1.86 65.63,15.36 64.13,16.86 51.33,16.86 50.13,18.06 50.13,19.06 49.83,19.36 49.83,20.46 50.08,20.71 68.88,20.71 71.43,18.16 71.43,0.06 70.23,-1.14 48.63,-1.14 47.83,-0.34 47.83,3.96 49.23,5.36 53.23,5.36 53.53,5.66

### Text on the board
tPlace: Designed in Aizu | MOTOR POWER | DC5V | JetBot | Rev.1.2.10 | #611
bPlace: S/N
Document: SR54F | 0.96INCH / OLED(BLUE) | 694106301002 | #611 JetBot Controller Board(Rev 1.2.10) / 2023/10/13